# Altium schematic sheet System.SchDoc
size A3 portrait; SheetNumber: 1; SheetTotal: 15
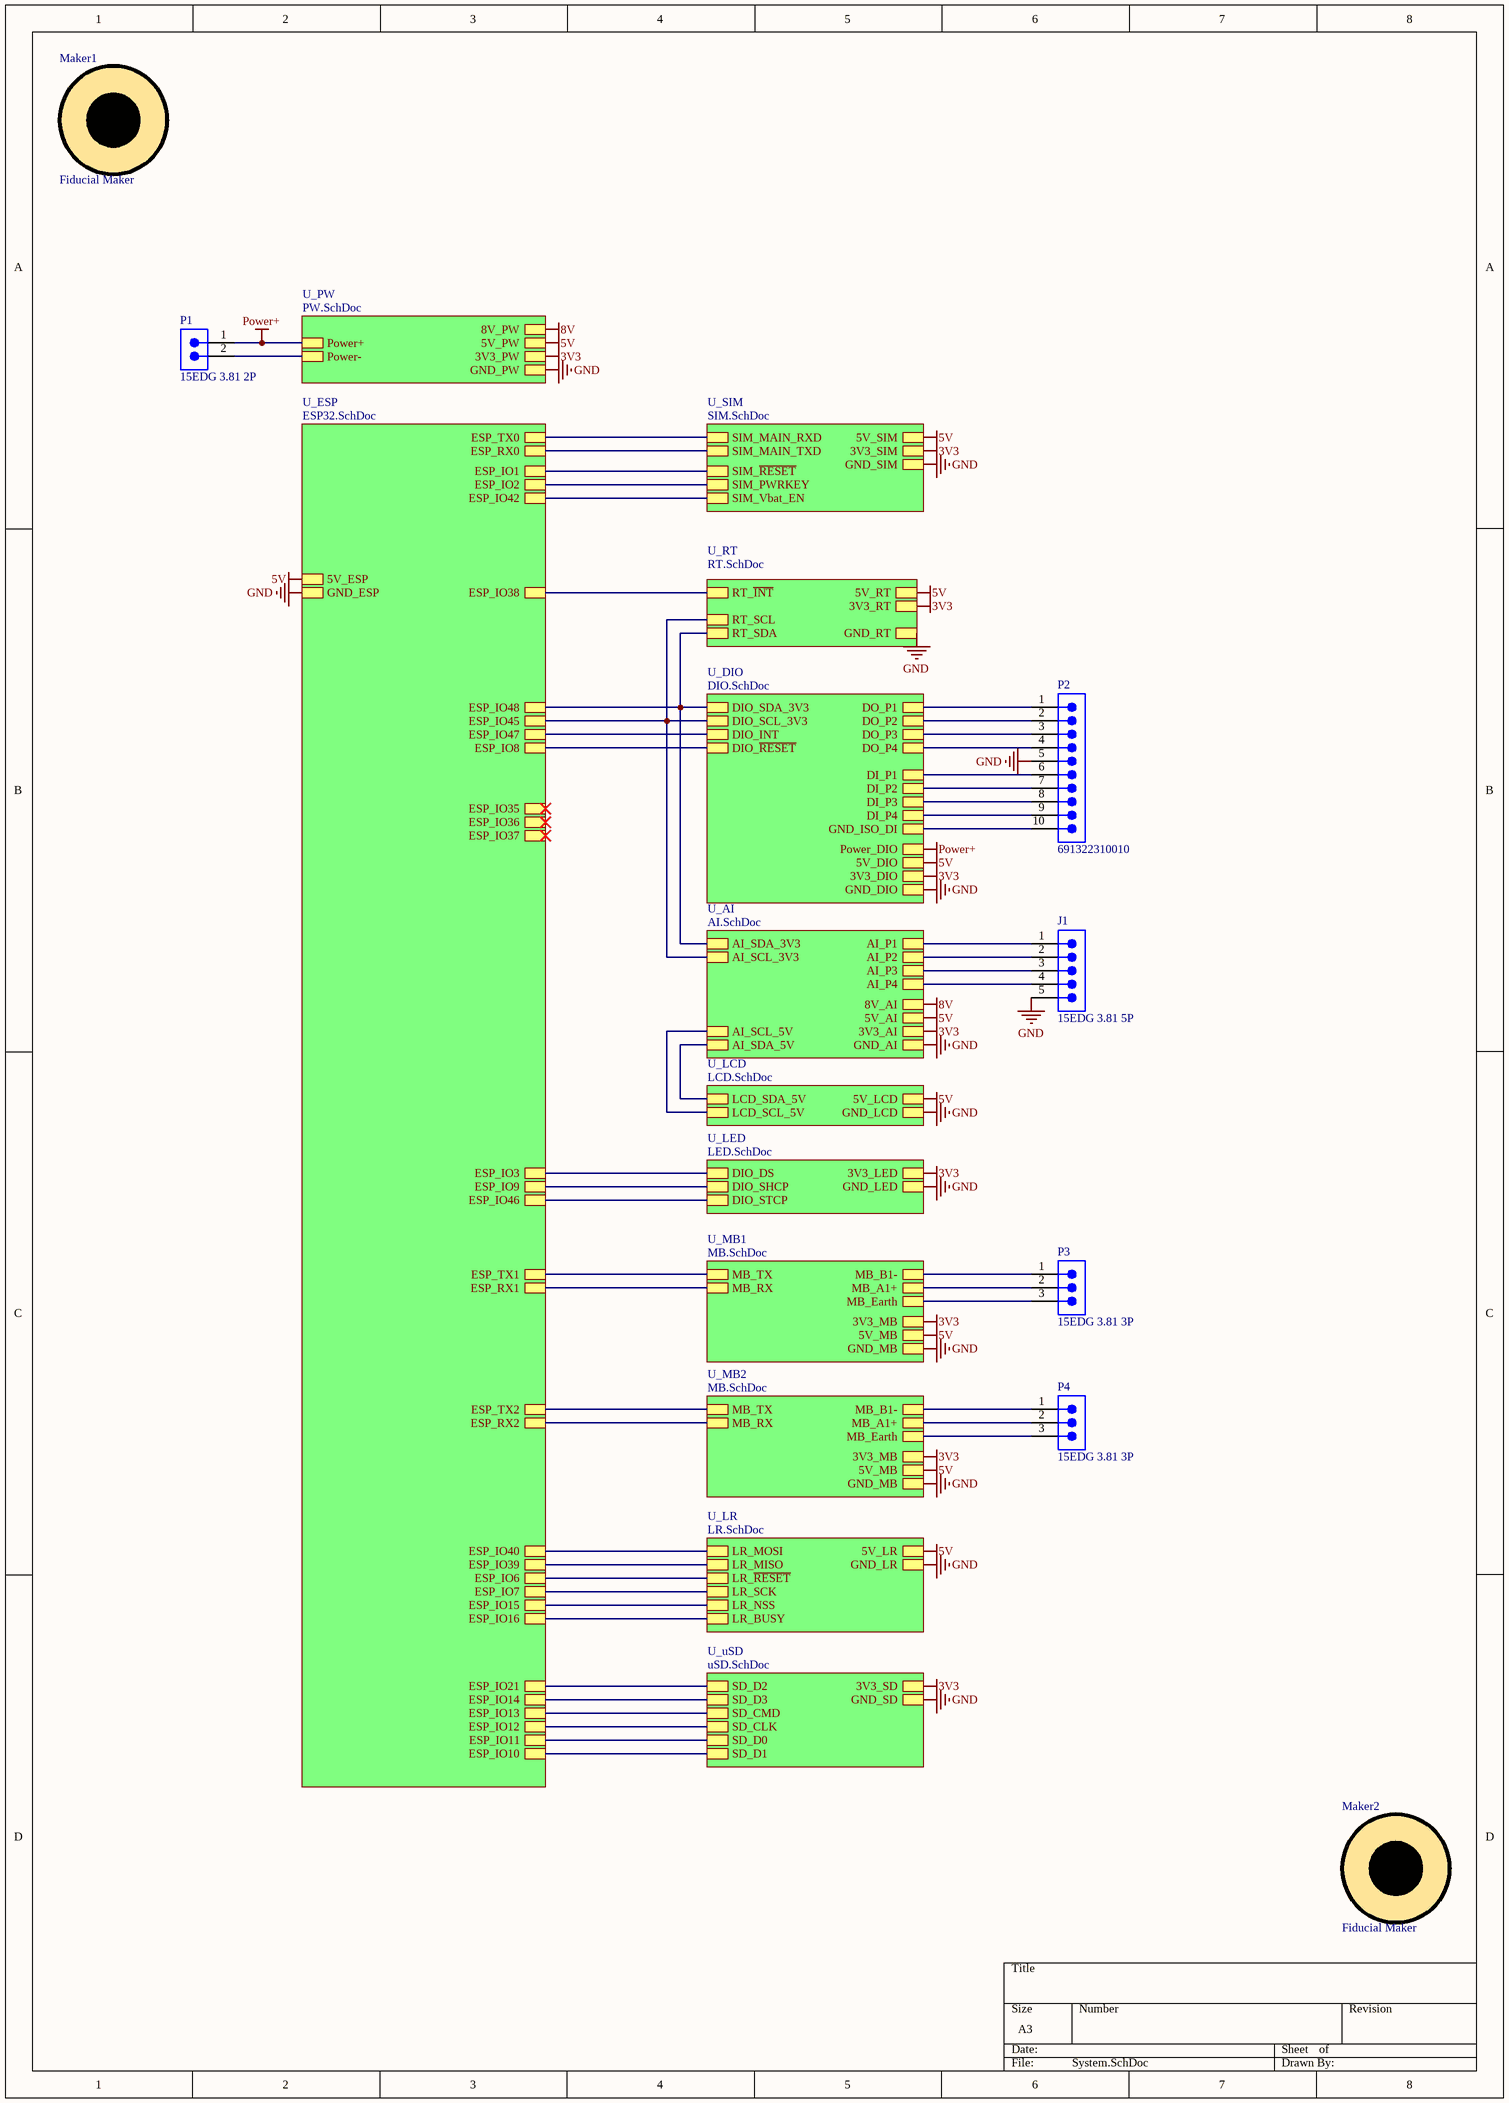
[diagram p0: System.SchDoc]

## Parts
J1  15EDG 3.81 5P  [691322310005]
Maker1  Fiducial Maker  [Fiducial Maker]
Maker2  Fiducial Maker  [Fiducial Maker]
P1  15EDG 3.81 2P  [691322310002]
P2  691322310010  [691322310010]
P3  15EDG 3.81 3P  [691322310003]
P4  15EDG 3.81 3P  [691322310003]

## Sub-sheets
U_AI = AI.SchDoc: 3V3_AI, GND_AI, 8V_AI, 5V_AI, AI_P1, AI_P2, AI_P3, AI_P4, AI_SCL_5V, AI_SDA_5V, AI_SCL_3V3, AI_SDA_3V3
U_DIO = DIO.SchDoc: DIO_SCL_3V3, DIO_SDA_3V3, Power_DIO, 5V_DIO, 3V3_DIO, GND_DIO, DIO_INT, DO_P1, DO_P2, DO_P3, DO_P4, DI_P1, DI_P2, DI_P3, DI_P4, DIO_~{RESET}, GND_ISO_DI
U_ESP = ESP32.SchDoc: ESP_IO40, ESP_IO39, ESP_IO48, ESP_IO10, ESP_IO11, ESP_IO12, ESP_IO13, ESP_IO14, ESP_IO21, 5V_ESP, GND_ESP, ESP_RX2, ESP_TX2, ESP_IO47, ESP_TX1, ESP_RX1, ESP_IO3, ESP_IO45, ESP_IO8, ESP_IO6, ESP_IO15, ESP_IO16, ESP_IO7, ESP_IO9, ESP_IO46, ESP_IO35, ESP_IO36, ESP_IO37, ESP_IO38, ESP_RX0, ESP_TX0, ESP_IO1, ESP_IO42, ESP_IO2
U_LCD = LCD.SchDoc: GND_LCD, 5V_LCD, LCD_SDA_5V, LCD_SCL_5V
U_LED = LED.SchDoc: GND_LED, DIO_DS, DIO_SHCP, DIO_STCP, 3V3_LED
U_LR = LR.SchDoc: 5V_LR, GND_LR, LR_MISO, LR_SCK, LR_NSS, LR_BUSY, LR_~{RESET}, LR_MOSI
U_MB1 = MB.SchDoc: 5V_MB, GND_MB, MB_TX, MB_RX, MB_A1+, MB_B1-, MB_Earth, 3V3_MB
U_MB2 = MB.SchDoc: 5V_MB, GND_MB, MB_TX, MB_RX, MB_A1+, MB_B1-, MB_Earth, 3V3_MB
U_PW = PW.SchDoc: Power+, Power-, 5V_PW, GND_PW, 3V3_PW, 8V_PW
U_RT = RT.SchDoc: 3V3_RT, GND_RT, RT_SCL, RT_SDA, 5V_RT, RT_~{INT}
U_SIM = SIM.SchDoc: SIM_Vbat_EN, SIM_~{RESET}, SIM_MAIN_RXD, SIM_MAIN_TXD, 5V_SIM, GND_SIM, SIM_PWRKEY, 3V3_SIM
U_uSD = uSD.SchDoc: 3V3_SD, SD_D0, SD_D1, SD_D2, SD_D3, SD_CMD, SD_CLK, GND_SD

## Nets
3V3: sheet U_MB1/3V3_MB, sheet U_uSD/3V3_SD, sheet U_AI/3V3_AI, sheet U_PW/3V3_PW, sheet U_SIM/3V3_SIM, sheet U_MB2/3V3_MB, sheet U_LED/3V3_LED, sheet U_DIO/3V3_DIO, sheet U_RT/3V3_RT
5V: sheet U_MB1/5V_MB, sheet U_LR/5V_LR, sheet U_ESP/5V_ESP, sheet U_AI/5V_AI, sheet U_PW/5V_PW, sheet U_SIM/5V_SIM, sheet U_MB2/5V_MB, sheet U_LCD/5V_LCD, sheet U_DIO/5V_DIO, sheet U_RT/5V_RT
8V: sheet U_AI/8V_AI, sheet U_PW/8V_PW
GND: J1.5 P2.5 ; sheet U_MB1/GND_MB, sheet U_LR/GND_LR, sheet U_uSD/GND_SD, sheet U_ESP/GND_ESP, sheet U_AI/GND_AI, sheet U_PW/GND_PW, sheet U_SIM/GND_SIM, sheet U_MB2/GND_MB, sheet U_LCD/GND_LCD, sheet U_LED/GND_LED, sheet U_DIO/GND_DIO, sheet U_RT/GND_RT
Power+: P1.1 ; sheet U_PW/Power+, sheet U_DIO/Power_DIO
NetJ1_1: J1.1 ; sheet U_AI/AI_P1
NetJ1_2: J1.2 ; sheet U_AI/AI_P2
NetJ1_3: J1.3 ; sheet U_AI/AI_P3
NetJ1_4: J1.4 ; sheet U_AI/AI_P4
NetP1_2: P1.2 ; sheet U_PW/Power-
NetP2_1: P2.1 ; sheet U_DIO/DO_P1
NetP2_2: P2.2 ; sheet U_DIO/DO_P2
NetP2_3: P2.3 ; sheet U_DIO/DO_P3
NetP2_4: P2.4 ; sheet U_DIO/DO_P4
NetP2_6: P2.6 ; sheet U_DIO/DI_P1
NetP2_7: P2.7 ; sheet U_DIO/DI_P2
NetP2_8: P2.8 ; sheet U_DIO/DI_P3
NetP2_9: P2.9 ; sheet U_DIO/DI_P4
NetP2_10: P2.10 ; sheet U_DIO/GND_ISO_DI
NetP3_1: P3.1 ; sheet U_MB1/MB_B1-
NetP3_2: P3.2 ; sheet U_MB1/MB_A1+
NetP3_3: P3.3 ; sheet U_MB1/MB_Earth
NetP4_1: P4.1 ; sheet U_MB2/MB_B1-
NetP4_2: P4.2 ; sheet U_MB2/MB_A1+
NetP4_3: P4.3 ; sheet U_MB2/MB_Earth
(unnamed): sheet U_MB1/MB_TX, sheet U_ESP/ESP_TX1
(unnamed): sheet U_MB1/MB_RX, sheet U_ESP/ESP_RX1
(unnamed): sheet U_LR/LR_MISO, sheet U_ESP/ESP_IO39
(unnamed): sheet U_LR/LR_SCK, sheet U_ESP/ESP_IO7
(unnamed): sheet U_LR/LR_NSS, sheet U_ESP/ESP_IO15
(unnamed): sheet U_LR/LR_BUSY, sheet U_ESP/ESP_IO16
(unnamed): sheet U_LR/LR_~{RESET}, sheet U_ESP/ESP_IO6
(unnamed): sheet U_LR/LR_MOSI, sheet U_ESP/ESP_IO40
(unnamed): sheet U_uSD/SD_D0, sheet U_ESP/ESP_IO11
(unnamed): sheet U_uSD/SD_D1, sheet U_ESP/ESP_IO10
(unnamed): sheet U_uSD/SD_D2, sheet U_ESP/ESP_IO21
(unnamed): sheet U_uSD/SD_D3, sheet U_ESP/ESP_IO14
(unnamed): sheet U_uSD/SD_CMD, sheet U_ESP/ESP_IO13
(unnamed): sheet U_uSD/SD_CLK, sheet U_ESP/ESP_IO12
(unnamed): sheet U_ESP/ESP_IO48, sheet U_AI/AI_SDA_3V3, sheet U_DIO/DIO_SDA_3V3, sheet U_RT/RT_SDA
(unnamed): sheet U_ESP/ESP_RX2, sheet U_MB2/MB_RX
(unnamed): sheet U_ESP/ESP_TX2, sheet U_MB2/MB_TX
(unnamed): sheet U_ESP/ESP_IO47, sheet U_DIO/DIO_INT
(unnamed): sheet U_ESP/ESP_IO3, sheet U_LED/DIO_DS
(unnamed): sheet U_ESP/ESP_IO45, sheet U_AI/AI_SCL_3V3, sheet U_DIO/DIO_SCL_3V3, sheet U_RT/RT_SCL
(unnamed): sheet U_ESP/ESP_IO8, sheet U_DIO/DIO_~{RESET}
(unnamed): sheet U_ESP/ESP_IO9, sheet U_LED/DIO_SHCP
(unnamed): sheet U_ESP/ESP_IO46, sheet U_LED/DIO_STCP
(unnamed): sheet U_ESP/ESP_IO38, sheet U_RT/RT_~{INT}
(unnamed): sheet U_ESP/ESP_RX0, sheet U_SIM/SIM_MAIN_TXD
(unnamed): sheet U_ESP/ESP_TX0, sheet U_SIM/SIM_MAIN_RXD
(unnamed): sheet U_ESP/ESP_IO1, sheet U_SIM/SIM_~{RESET}
(unnamed): sheet U_ESP/ESP_IO42, sheet U_SIM/SIM_Vbat_EN
(unnamed): sheet U_ESP/ESP_IO2, sheet U_SIM/SIM_PWRKEY
(unnamed): sheet U_AI/AI_SCL_5V, sheet U_LCD/LCD_SCL_5V
(unnamed): sheet U_AI/AI_SDA_5V, sheet U_LCD/LCD_SDA_5V

## Library data of the parts
J1 = CMP-1502-01889-2: Cầu Đấu Terminal Cong 15EDG 3.81mm 5P; NexarPartId: 8917780; Gender: Male; Current: 10A; Number of Positions Per Level: 5; Voltage: 300V; Number of Levels: 1; Number of Rows: 1; Contact Plating: Tin; Contact Material: Brass; Length: 10.5mm; Lead Pitch: 3.81mm; Width: 20.44mm; Number of Pins: 5; Termination: Solder; Color: Green; Packaging: Box; Mount: Through Hole; REACH SVHC: Unknown; Height: 9.2mm; RoHS: Compliant; Pitch: 3.81mm; Number of Contacts: 5; ComponentLink1Description: New link; ComponentLink1URL: https://linhkienthanhcong.com/cau-dau-terminal-cong-15edg-3-81mm-5p
P1 = CMP-1502-01886-2: NexarPartId: 8917777; Number of Levels: 1; Voltage Rating: 300V; Gender: Male; Pitch: 3.81mm; Number of Positions Per Level: 2; Current Rating: 10A; Number of Pins: 2; Number of Rows: 1; Height: 7.2mm; Contact Material: Brass; Termination: Solder; Min Operating Temperature: -40°C; Max Operating Temperature: 105°C; Contact Plating: Tin; Number of Contacts: 2; REACH SVHC: Unknown; Color: Green; Packaging: Box; Voltage: 300V; Width: 9.01mm; Current: 10A; Length: 10.5mm; Mount: Through Hole; Lead Pitch: 3.81mm; RoHS: Compliant
P2 = CMP-1502-01894-2: NexarPartId: 46988695; Number of Contacts: 10; Gender: Male; Voltage Rating: 300V; Current Rating: 10A; Lead Pitch: 3.81mm; Number of Rows: 1; Contact Material: Tin; Height: 7.2mm; Min Operating Temperature: -40°C; Packaging: Box; Number of Pins: 10; Max Operating Temperature: 105°C
P3 P4 = CMP-1502-01887-2: NexarPartId: 8917778; Pitch: 3.81mm; Number of Positions Per Level: 3; Current: 10A; Voltage: 300V; Number of Levels: 1; Gender: Male; Termination: Solder; Number of Rows: 1; Contact Plating: Tin; Packaging: Box; Height: 9.2mm; Mount: Through Hole; Number of Contacts: 3; Width: 12.82mm; Lead Pitch: 3.81mm; REACH SVHC: Unknown; RoHS: Compliant; Length: 10.5mm; Number of Pins: 3; Color: Green; Contact Material: Brass